# Altium schematic sheet PowerPlane.SchDoc
size A3; SPICEModelCacheFFDZJAYD: <root> / <DocumentId>FFDZJAYD</DocumentId> / <CacheFrame Number="0"> / <Model Name="1n4007" Kind="MDL"> / <Text>*1N4007 MCE 8-16-95 / *1000V 1A Si GenPurpose Diode pkg:DIODE0.4 1,2 / .MODEL 1N4007 D(IS=2.55E-9 RS=0.042 N=1.75 TT=5.76E-6 CJO=1.85E-11 / + VJ=0.75 M=0.333 BV=1000 IBV=9.86E-5 )</Text> / </Model> / <Model Name="npn" Kind="MDL"> / <Text>*Default NPN BJT / *NPN Trans Pinout: C,B,E / .MODEL NPN NPN()</Text> / </Model> / </CacheFrame> / </root>
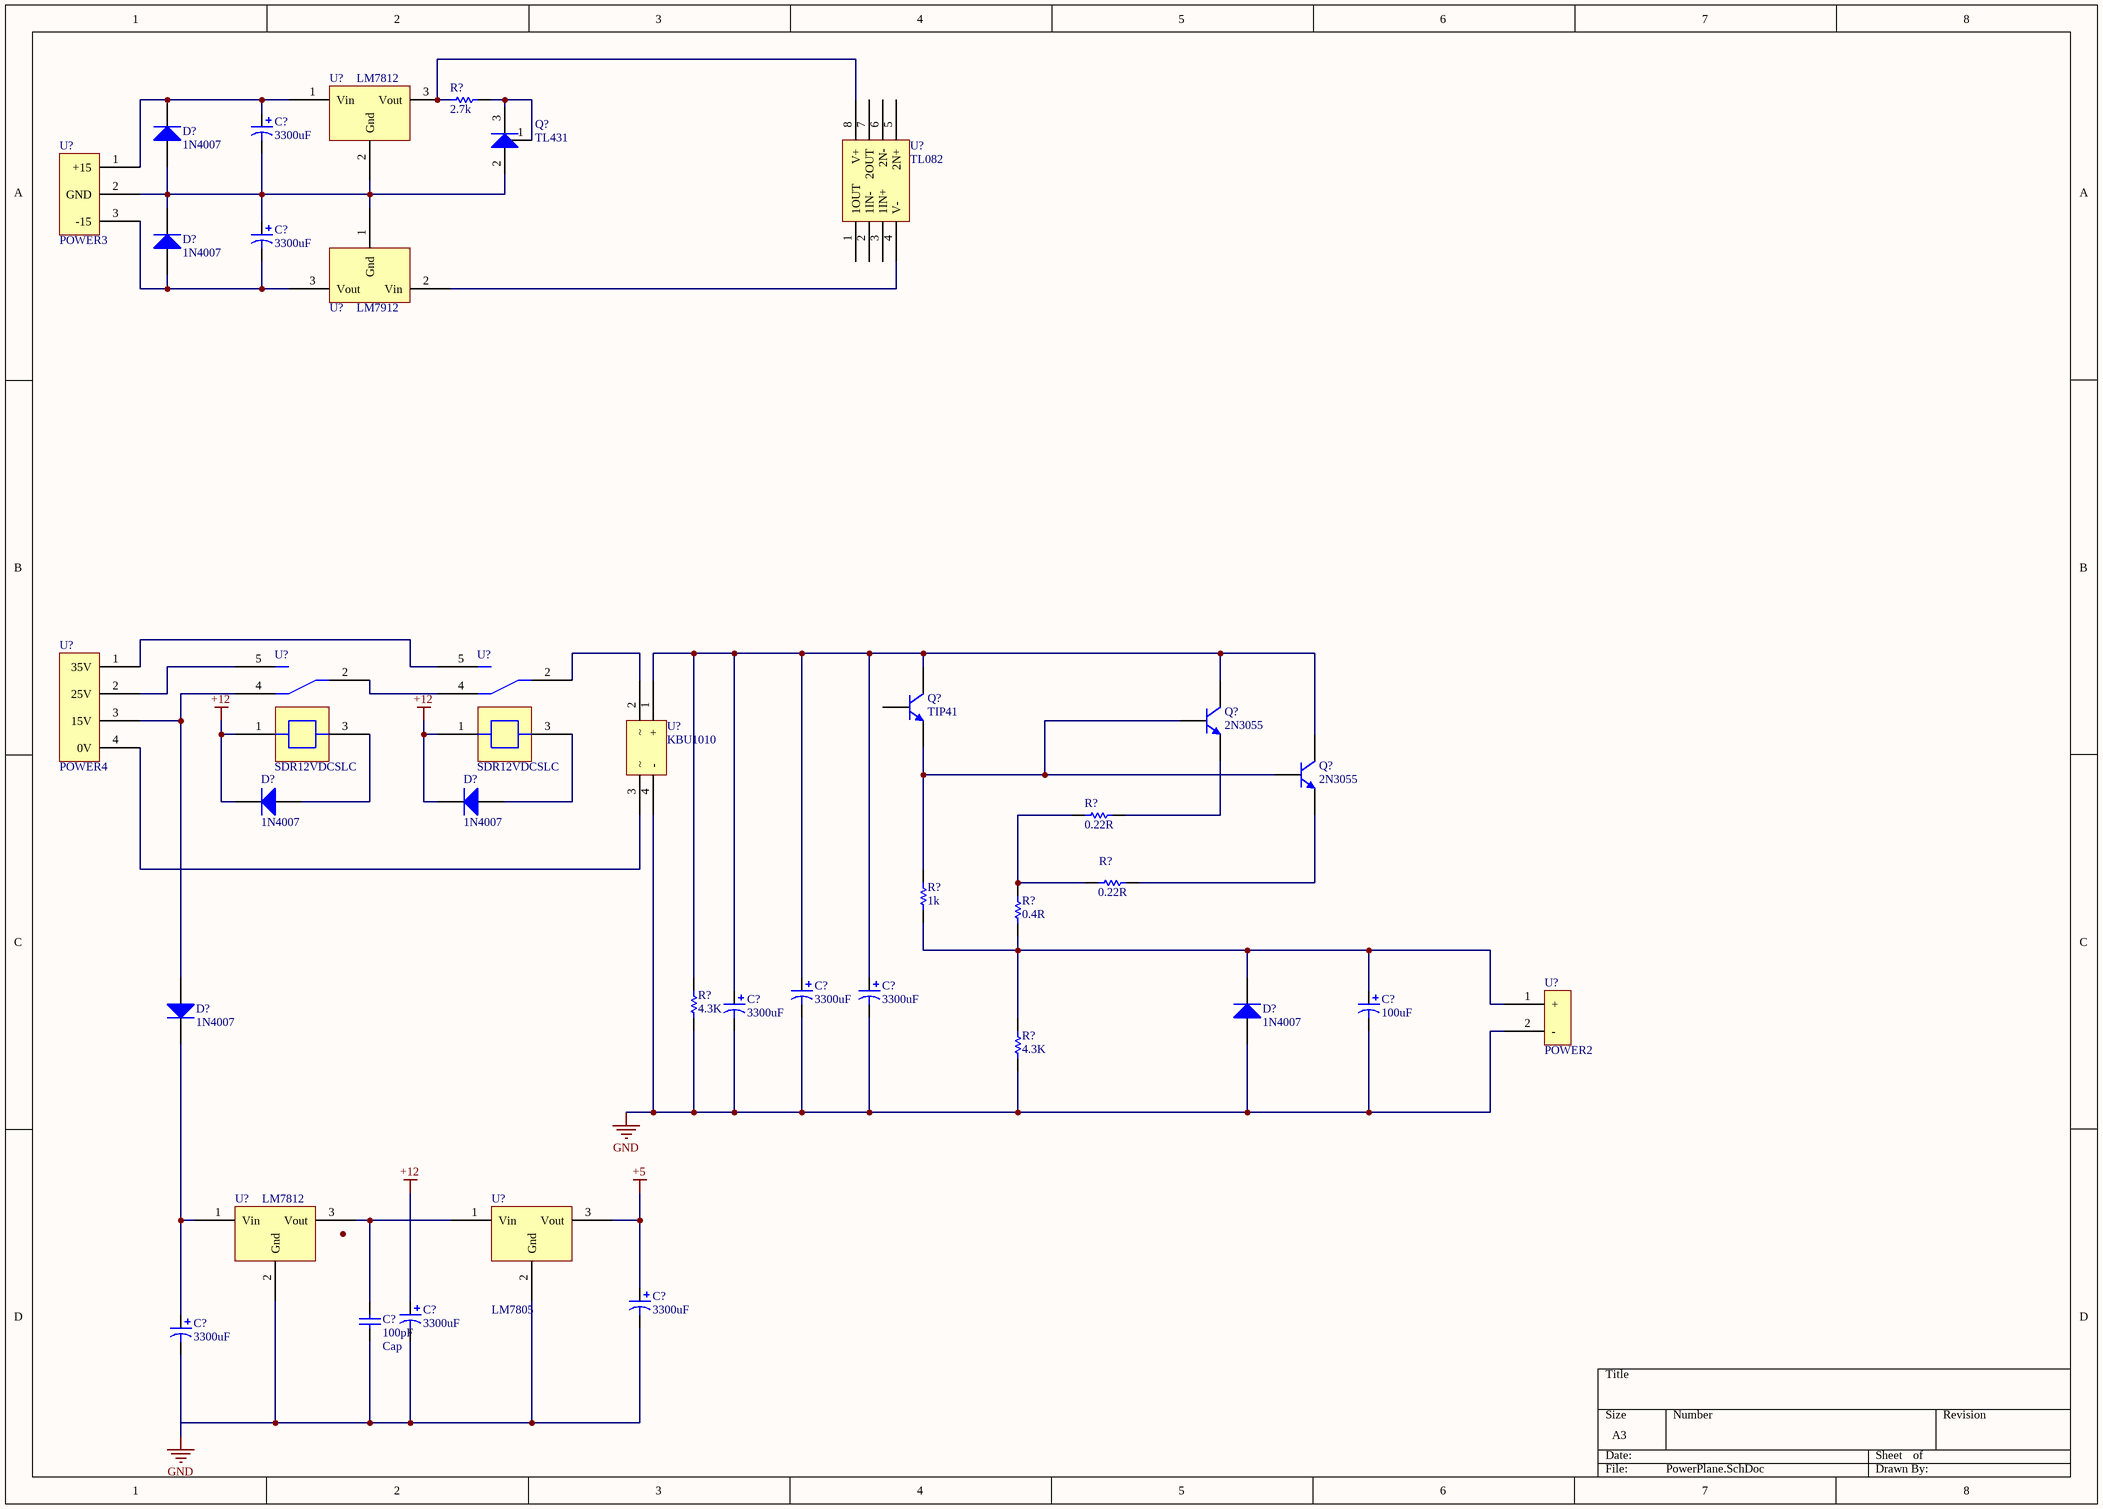
[diagram p0: PowerPlane.SchDoc]

## Parts
(Parts that share a designator on the sheet are numbered #1, #2 ... from top to bottom, then left to right.)
C?#1  value 3300uF  [RB7.6-15]  (hidden comment: Cap Pol1)
C?#2  value 3300uF  [RB7.6-15]  (hidden comment: Cap Pol1)
C?#3  value 3300uF  [RB7.6-15]  (hidden comment: Cap Pol1)
C?#4  value 3300uF  [RB7.6-15]  (hidden comment: Cap Pol1)
C?#5  value 3300uF  [RB7.6-15]  (hidden comment: Cap Pol1)
C?#6  value 100uF  [RB7.6-15]  (hidden comment: Cap Pol1)
C?#7  value 3300uF  [RB7.6-15]  (hidden comment: Cap Pol1)
C?#8  value 3300uF  [RB7.6-15]  (hidden comment: Cap Pol1)
C?#9  value 3300uF  [RB7.6-15]  (hidden comment: Cap Pol1)
C?#10  Cap  value 100pF  [RAD-0.3]
D?#1  1N4007  [DO-41]
D?#2  1N4007  [DO-41]
D?#3  1N4007  [DO-41]
D?#4  1N4007  [DO-41]
D?#5  1N4007  [DO-41]
D?#6  1N4007  [DO-41]
Q?#1  TL431
Q?#2  TIP41  [TO-226-AA]
Q?#3  2N3055  [TO-226-AA]
Q?#4  2N3055  [TO-226-AA]
R?#1  value 2.7k  [AXIAL-0.3]  (hidden comment: Res1)
R?#2  value 0.22R  [AXIAL-0.3]  (hidden comment: Res1)
R?#3  value 0.22R  [AXIAL-0.3]  (hidden comment: Res1)
R?#4  value 1k  [AXIAL-0.3]  (hidden comment: Res1)
R?#5  value 0.4R  [AXIAL-0.3]  (hidden comment: Res1)
R?#6  value 4.3K  [AXIAL-0.3]  (hidden comment: Res1)
R?#7  value 4.3K  [AXIAL-0.3]  (hidden comment: Res1)
U?#1  LM7812
U?#2  TL082
U?#3  POWER3
U?#4  LM7912
U?#5  POWER4
U?#6  SDR12VDCSLC
U?#7  SDR12VDCSLC
U?#8  KBU1010
U?#9  POWER2
U?#10  LM7812
U?#11  LM7805

## Nets
+5: C?#7.1 U?#11.3(Vout)
+12: C?#8.1 C?#10.2 D?#3.2(K) D?#4.2(K) U?#6.1(V+) U?#7.1(V+) U?#10.3(Vout) U?#11.1(Vin)
GND: C?#3.2 C?#4.2 C?#5.2 C?#6.2 C?#7.2 C?#8.2 C?#9.2 C?#10.1 D?#6.1(A) R?#6.1 R?#7.1 U?#8.4(-) U?#9.2(-) U?#10.2(Gnd) U?#11.2(Gnd)
NetC?#1_1: C?#1.1 D?#1.2(K) U?#1.1(Vin) U?#3.1(+15)
NetC?#1_2: C?#1.2 C?#2.1 D?#1.1(A) D?#2.2(K) Q?#1.2(A) U?#1.2(Gnd) U?#3.2(GND) U?#4.1(Gnd)
NetC?#2_2: C?#2.2 D?#2.1(A) U?#3.3(-15) U?#4.3(Vout)
NetC?#3_1: C?#3.1 C?#4.1 C?#5.1 Q?#2.1(C) Q?#3.1(C) Q?#4.1(C) R?#6.2 U?#8.1(+)
NetC?#6_1: C?#6.1 D?#6.2(K) R?#4.1 R?#5.1 R?#7.2 U?#9.1(+)
NetC?#9_1: C?#9.1 D?#5.2(K) U?#10.1(Vin)
NetD?#3_1: D?#3.1(A) U?#6.3(V-)
NetD?#4_1: D?#4.1(A) U?#7.3(V-)
NetD?#5_1: D?#5.1(A) U?#5.3(15V) U?#6.4(I)
NetQ?#1_1: Q?#1.1(REF) Q?#1.3(K) R?#1.2
NetQ?#2_3: Q?#2.3(E) Q?#3.2(B) Q?#4.2(B) R?#4.2
NetQ?#3_3: Q?#3.3(E) R?#2.1
NetQ?#4_3: Q?#4.3(E) R?#3.1
NetR?#1_1: R?#1.1 U?#1.3(Vout) U?#2.8(V+)
NetR?#2_2: R?#2.2 R?#3.2 R?#5.2
NetU?#2_4: U?#2.4(V-) U?#4.2(Vin)
NetU?#5_1: U?#5.1(35V) U?#7.5(O)
NetU?#5_2: U?#5.2(25V) U?#6.5(O)
NetU?#5_4: U?#5.4(0V) U?#8.3
NetU?#6_2: U?#6.2(C) U?#7.4(I)
NetU?#7_2: U?#7.2(C) U?#8.2

Not connected (* = marked no-connect by the designer): Q?#2 2(B); U?#2 1(1OUT) 2(1IN-) 3(1IN+) 5(2N+) 6(2N-) 7(2OUT)

## Library data of the parts
C?#1-C?#9 = Cap Pol1: Polarized Capacitor (Radial); Published: 8-Jun-2000; LatestRevisionDate: 17-Jul-2002; LatestRevisionNote: Re-released for DXP Platform.; PackageReference: RB7.6-15; Publisher: Altium Limited; PackageDescription: Polarized Capacitor (Radial); 2 Leads
C?#10 = Cap: Capacitor; Published: 8-Jun-2000; LatestRevisionDate: 17-Jul-2002; LatestRevisionNote: Re-released for DXP Platform.; PackageReference: RAD-0.3; Publisher: Altium Limited; PackageDescription: Radial Cap, Thru-Hole; 2 Leads; 0.3 in Pin Spacing
D?#1-D?#6 = Diode 1N4007: 1 Amp General Purpose Rectifier; Published: 8-Jun-2000; LatestRevisionDate: 17-Jul-2002; LatestRevisionNote: Re-released for DXP Platform.; DatasheetVersion: 1998; PackageVersion: Aug-1999; PackageReference: DO-41; Publisher: Altium Limited; PackageDescription: Diode, Axial; Body 5.2 x 2.7 mm (LxDia. max), Lead Dia. 0.86 mm (max); Code_JEDEC: DO-204-AL; ComponentLink1Description: Manufacturer Link; ComponentLink1URL: http://www.fairchildsemi.com/; ComponentLink2Description: Datasheet; ComponentLink2URL: http://www.fairchildsemi.com/ds/1N%2F1N4001.pdf
Q?#2 = NPN: Published: 8-Jun-2000; LatestRevisionDate: 17-Jul-2002; LatestRevisionNote: Re-released for DXP Platform.; PackageReference: TO-226-AA; Publisher: Altium Limited; PackageDescription: TO, Flat Index; 3 In-Line, Axial Leads; Body Dia. 4.8mm; Leads 0.55 x 0.51 mm (max); Code_JEDEC: TO-226-AA
Q?#3 Q?#4 = NPN: NPN Bipolar Transistor; Published: 8-Jun-2000; LatestRevisionDate: 17-Jul-2002; LatestRevisionNote: Re-released for DXP Platform.; PackageReference: TO-226-AA; Publisher: Altium Limited; PackageDescription: TO, Flat Index; 3 In-Line, Axial Leads; Body Dia. 4.8mm; Leads 0.55 x 0.51 mm (max); Code_JEDEC: TO-226-AA
R?#1-R?#7 = Res1: Resistor; Published: 8-Jun-2000; LatestRevisionDate: 17-Jul-2002; LatestRevisionNote: Re-released for DXP Platform.; PackageReference: AXIAL-0.3; Publisher: Altium Limited; PackageDescription: Axial Device, Thru-Hole; 2 Leads; 0.3 in Pin Spacing